# EAGLE design LEDBoard (EAGLE 8.4.1)
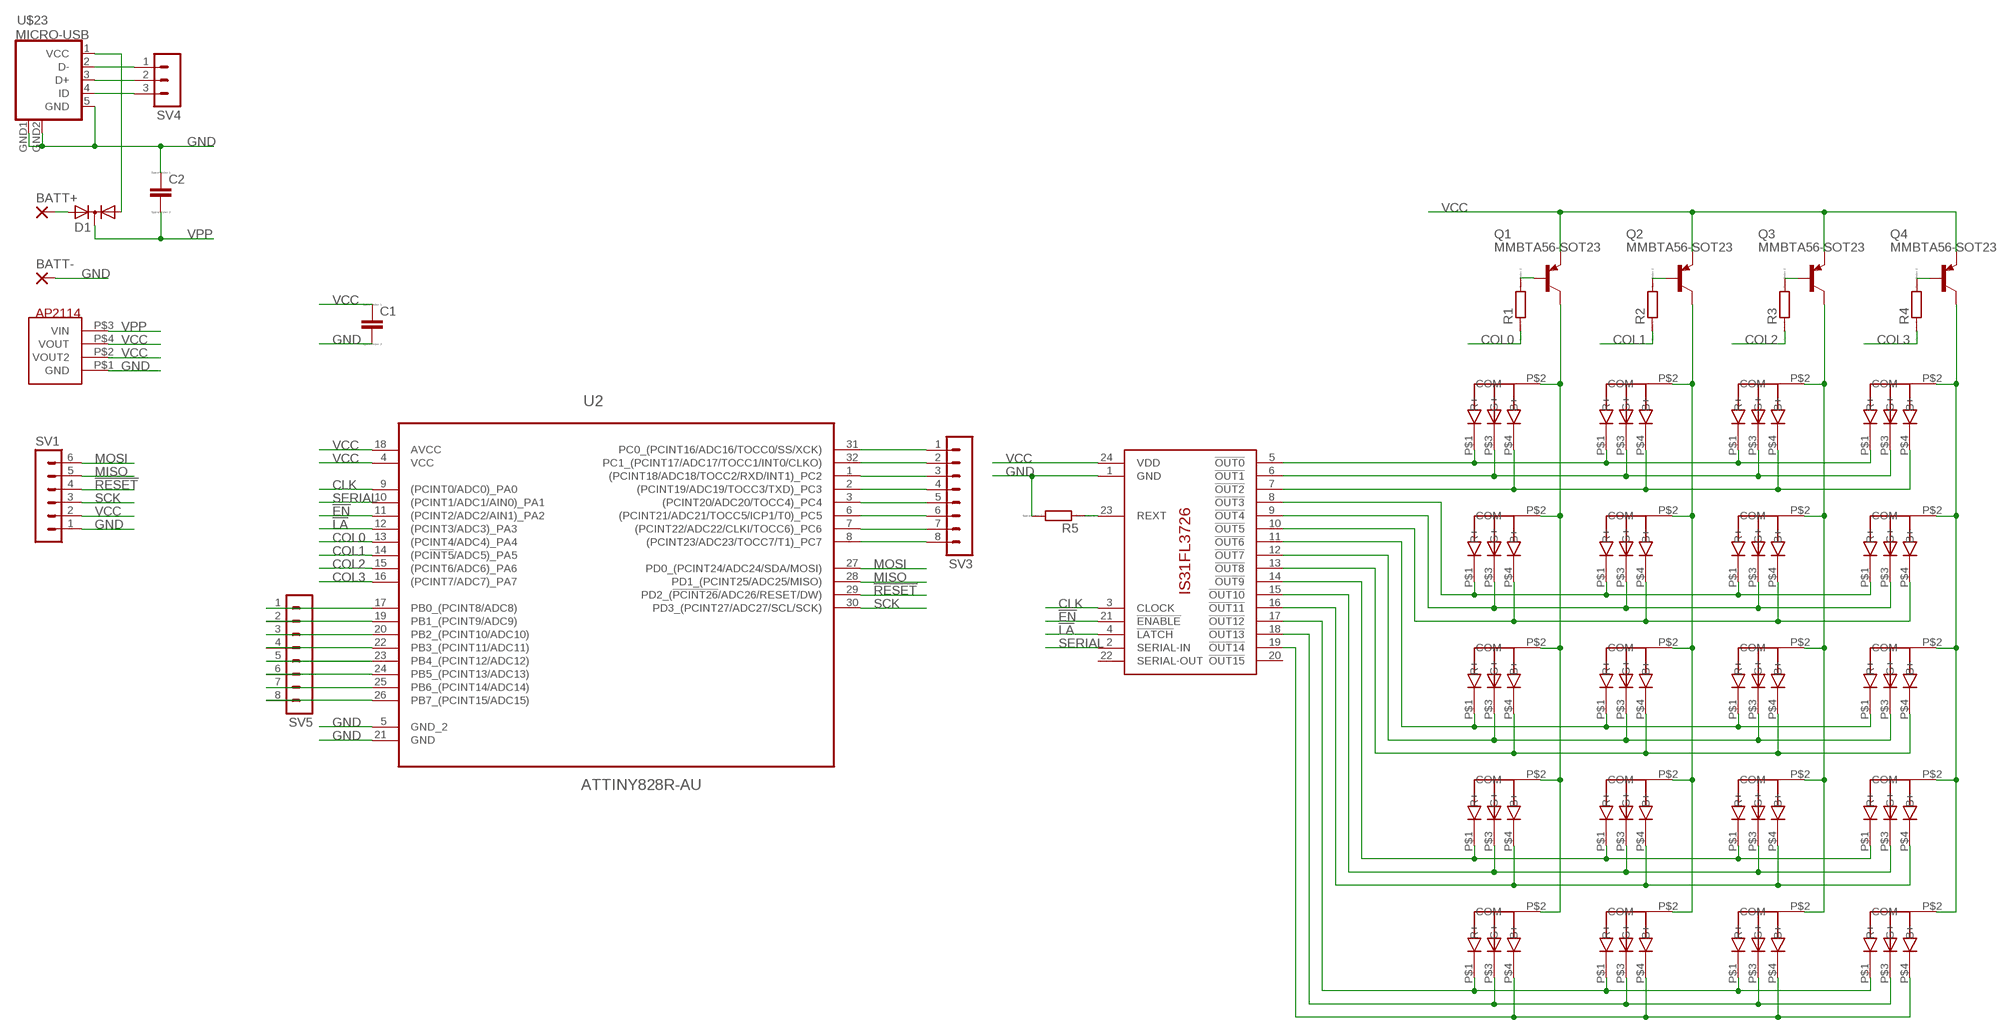
[diagram p0: schematic, sheet 1]

## Parts
BATT+  2,54/1,1  [2,54/1,1]
BATT-  2,54/1,1  [2,54/1,1]
C1  CC1206  [C1206]
C2  CC1206  [C1206]
D1  DIODE-2AC|CASOT23  [SOT23]
Q1  MMBTA56-SOT23  [SOT23]
Q2  MMBTA56-SOT23  [SOT23]
Q3  MMBTA56-SOT23  [SOT23]
Q4  MMBTA56-SOT23  [SOT23]
R1  RR1206  [R1206]
R2  RR1206  [R1206]
R3  RR1206  [R1206]
R4  RR1206  [R1206]
R5  RR1206  [R1206]
SV1  MA06-1  [MA06-1]
SV3  MA08-1  [MA08-1]
SV4  MA03-1  [MA03-1]
SV5  MA08-1  [MA08-1]
U2  ATTINY828R-AU  [QFP80P900X900X120-32N]
U$1  IS31FL3726  [TSSOP-24]
U$2  AP2114H  [SOT233]
U$3  3528LED  [3528]
U$4  3528LED  [3528]
U$5  3528LED  [3528]
U$6  3528LED  [3528]
U$7  3528LED  [3528]
U$8  3528LED  [3528]
U$9  3528LED  [3528]
U$10  3528LED  [3528]
U$11  3528LED  [3528]
U$12  3528LED  [3528]
U$13  3528LED  [3528]
U$14  3528LED  [3528]
U$15  3528LED  [3528]
U$16  3528LED  [3528]
U$17  3528LED  [3528]
U$18  3528LED  [3528]
U$19  3528LED  [3528]
U$20  3528LED  [3528]
U$21  3528LED  [3528]
U$22  3528LED  [3528]
U$23  MICRO-USB  [MICRO-USB]

## Nets
!EN: U2.11((PCINT2/ADC2/AIN1)_PA2) U$1.21(!ENABLE)
!LA: U2.12((PCINT3/ADC3)_PA3) U$1.4(!LATCH)
!RESET: SV1.4 U2.29(PD2_(!PCINT26!/ADC26/RESET/DW))
CLK: U2.9((PCINT0/ADC0)_PA0) U$1.3(CLOCK)
COL0: R1.1 U2.13((PCINT4/ADC4)_PA4)
COL1: R2.1 U2.14((PC!INT5!/ADC5)_PA5)
COL2: R3.1 U2.15((PCINT6/ADC6)_PA6)
COL3: R4.1 U2.16((PCINT7/ADC7)_PA7)
GND: BATT-.1(P) C1.2 C2.1 R5.2 SV1.1 U2.5(GND_2) U2.21(GND) U$1.1(GND) U$2.P$1(GND) U$23.5(GND) U$23.GND1(GND) U$23.GND2(GND)
MISO: SV1.5 U2.28(PD1_(PCINT25/ADC25/MISO))
MOSI: SV1.6 U2.27(PD0_(PCINT24/ADC24/SDA/MOSI))
N$1: SV3.1 U2.31(PC0_(PCINT16/ADC16/TOCC0/SS/XCK))
N$2: SV3.2 U2.32(PC1_(PCINT17/ADC17/TOCC1/INT0/CLKO))
N$3: U$1.5(!OUT0) U$7.P$1(R+) U$8.P$1(R+) U$9.P$1(R+) U$10.P$1(R+)
N$4: U$1.6(!OUT1) U$7.P$3(G+) U$8.P$3(G+) U$9.P$3(G+) U$10.P$3(G+)
N$5: U$1.7(!OUT2) U$7.P$4(B+) U$8.P$4(B+) U$9.P$4(B+) U$10.P$4(B+)
N$6: U$1.8(!OUT3) U$3.P$1(R+) U$4.P$1(R+) U$5.P$1(R+) U$6.P$1(R+)
N$7: U$1.9(!OUT4) U$3.P$3(G+) U$4.P$3(G+) U$5.P$3(G+) U$6.P$3(G+)
N$8: U$1.10(!OUT5) U$3.P$4(B+) U$4.P$4(B+) U$5.P$4(B+) U$6.P$4(B+)
N$9: U$1.11(!OUT6) U$11.P$1(R+) U$12.P$1(R+) U$13.P$1(R+) U$14.P$1(R+)
N$10: U$1.12(!OUT7) U$11.P$3(G+) U$12.P$3(G+) U$13.P$3(G+) U$14.P$3(G+)
N$11: U$1.13(!OUT8) U$11.P$4(B+) U$12.P$4(B+) U$13.P$4(B+) U$14.P$4(B+)
N$12: U$1.14(!OUT9) U$15.P$1(R+) U$16.P$1(R+) U$17.P$1(R+) U$18.P$1(R+)
N$13: U$1.15(!OUT10) U$15.P$3(G+) U$16.P$3(G+) U$17.P$3(G+) U$18.P$3(G+)
N$14: U$1.16(!OUT11) U$15.P$4(B+) U$16.P$4(B+) U$17.P$4(B+) U$18.P$4(B+)
N$15: U$1.17(!OUT12) U$19.P$1(R+) U$20.P$1(R+) U$21.P$1(R+) U$22.P$1(R+)
N$16: U$1.18(!OUT13) U$19.P$3(G+) U$20.P$3(G+) U$21.P$3(G+) U$22.P$3(G+)
N$17: U$1.19(!OUT14) U$19.P$4(B+) U$20.P$4(B+) U$21.P$4(B+) U$22.P$4(B+)
N$18: Q1.3(C) U$3.P$2(COM) U$7.P$2(COM) U$11.P$2(COM) U$15.P$2(COM) U$22.P$2(COM)
N$19: Q2.3(C) U$4.P$2(COM) U$8.P$2(COM) U$12.P$2(COM) U$16.P$2(COM) U$21.P$2(COM)
N$20: Q3.3(C) U$5.P$2(COM) U$9.P$2(COM) U$13.P$2(COM) U$17.P$2(COM) U$20.P$2(COM)
N$21: Q4.3(C) U$6.P$2(COM) U$10.P$2(COM) U$14.P$2(COM) U$18.P$2(COM) U$19.P$2(COM)
N$22: Q1.1(B) R1.2
N$23: Q2.1(B) R2.2
N$24: Q3.1(B) R3.2
N$25: Q4.1(B) R4.2
N$26: R5.1 U$1.23(REXT)
N$27: SV3.3 U2.1((PCINT18/ADC18/TOCC2/RXD/INT1)_PC2)
N$28: SV3.4 U2.2((PCINT19/ADC19/TOCC3/TXD)_PC3)
N$29: SV3.5 U2.3((PCINT20/ADC20/TOCC4)_PC4)
N$30: SV3.6 U2.6((PCINT21/ADC21/TOCC5/ICP1/T0)_PC5)
N$31: SV3.7 U2.7((PCINT22/ADC22/CLKI/TOCC6)_PC6)
N$32: SV3.8 U2.8((PCINT23/ADC23/TOCC7/T1)_PC7)
N$33: SV5.1 U2.17(PB0_(PCINT8/ADC8))
N$34: SV5.2 U2.19(PB1_(PCINT9/ADC9))
N$35: SV5.3 U2.20(PB2_(PCINT10/ADC10))
N$36: SV5.4 U2.22(PB3_(PCINT11/ADC11))
N$37: SV5.5 U2.23(PB4_(PCINT12/ADC12))
N$38: SV5.6 U2.24(PB5_(PCINT13/ADC13))
N$39: SV5.7 U2.25(PB6_(PCINT14/ADC14))
N$40: SV5.8 U2.26(PB7_(PCINT15/ADC15))
N$41: SV4.1 U$23.2(D-)
N$42: D1.1(A1) U$23.1(VCC)
N$43: SV4.2 U$23.3(D+)
N$44: BATT+.1(P) D1.2(A2)
N$45: SV4.3 U$23.4(ID)
SCK: SV1.3 U2.30(PD3_(PCINT27/ADC27/SCL/SCK))
SERIAL: U2.10((PCINT1/ADC1/AIN0)_PA1) U$1.2(SERIAL-IN)
VCC: C1.1 Q1.2(E) Q2.2(E) Q3.2(E) Q4.2(E) SV1.2 U2.4(VCC) U2.18(AVCC) U$1.24(VDD) U$2.P$2(VOUT2) U$2.P$4(VOUT)
VPP: C2.2 D1.3(C) U$2.P$3(VIN)
Unconnected: U$1.20(!OUT15) U$1.22(SERIAL-OUT)

## Library data of the parts
BATT+ BATT- = wirepad:2,54/1,1: THROUGH-HOLE PAD
C1 C2 = eagle-ltspice:C: CAPACITOR, European symbol; SPICEMODEL: NONE; SPICEPREFIX: C
D1 = diode:DIODE-2AC|CA: Dual DIODE Anode-Cathode|Cathode-Anode
Q1-Q4 = transistor-pnp:*-?: PNP Transistor
R1-R5 = eagle-ltspice:R: RESISTOR, European symbol; SPICEMODEL: NONE; SPICEPREFIX: R
SV1 = con-lstb:MA06-1: PIN HEADER; OC_FARNELL: unknown; OC_NEWARK: unknown
SV3 SV5 = con-lstb:MA08-1: PIN HEADER; OC_FARNELL: unknown; OC_NEWARK: unknown
SV4 = con-lstb:MA03-1: PIN HEADER; OC_FARNELL: unknown; OC_NEWARK: unknown
U2 = Custom:ATTINY828R-AU: IC, MCU, 8KB, FLASH, 20MHZ, TQFP-32; MPN: ATTINY828R-AU; OC_FARNELL: 2249850; OC_NEWARK: Unknown; PACKAGE: TQFP-32; SUPPLIER: ATMEL
U$1 = Custom:IS31FL3726
U$2 = Custom:AP2114H
U$3-U$22 = Custom:3528LED
U$23 = microusb:MICRO-USB: Micro USB B connector

## Board
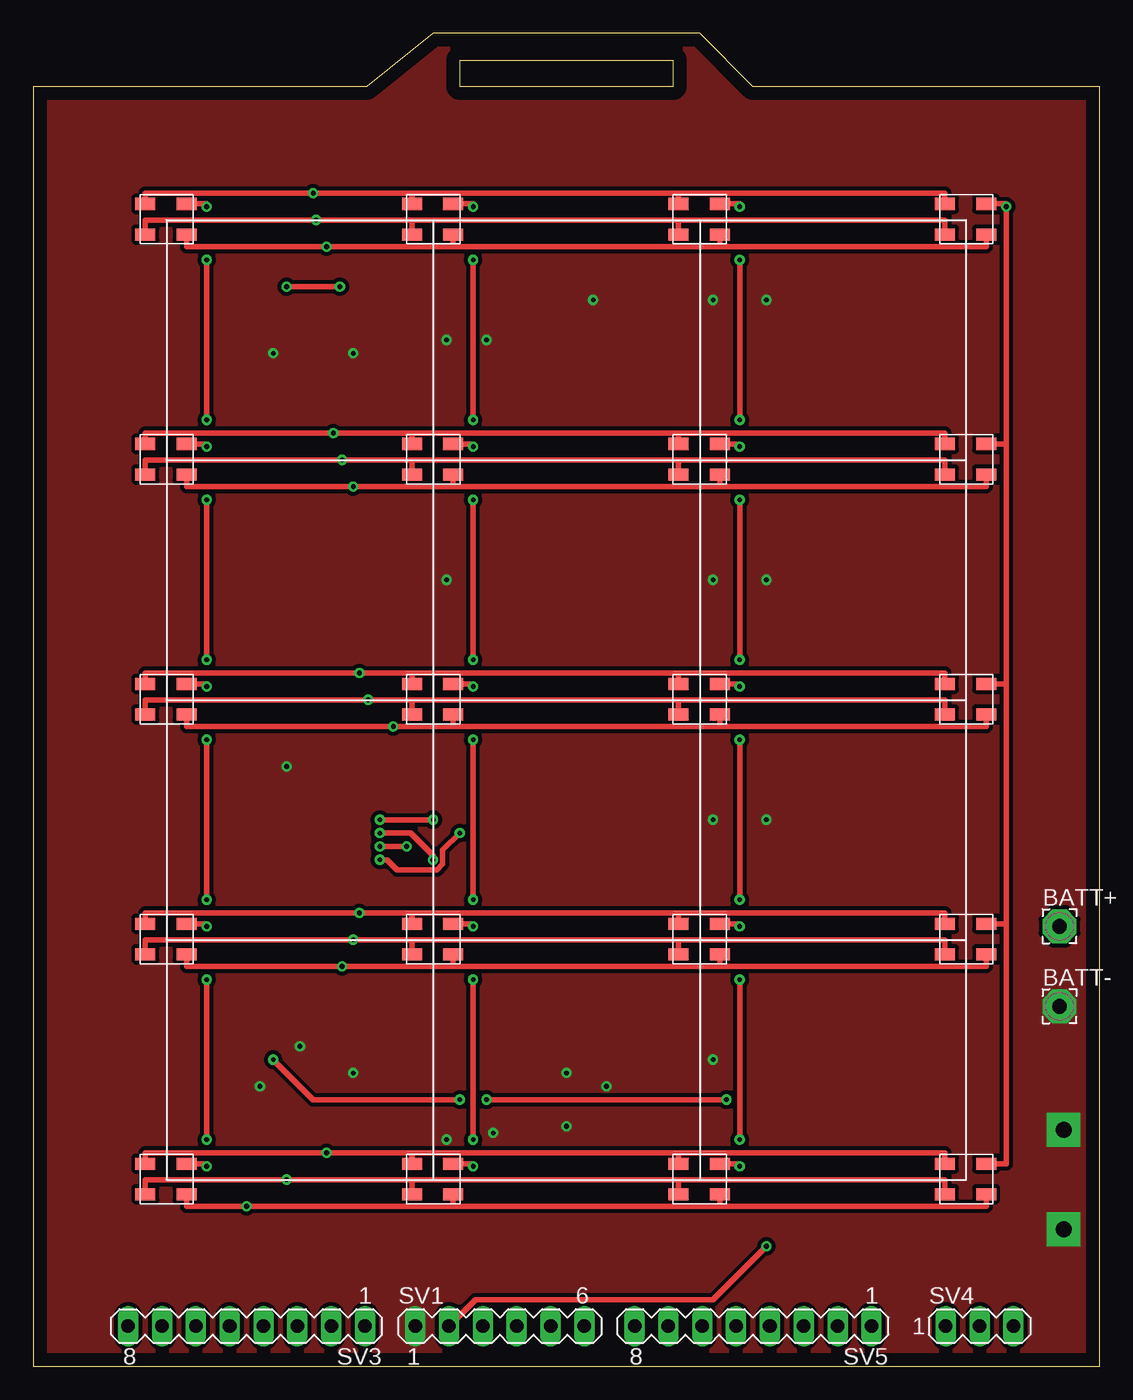
[diagram p1: board, top side]
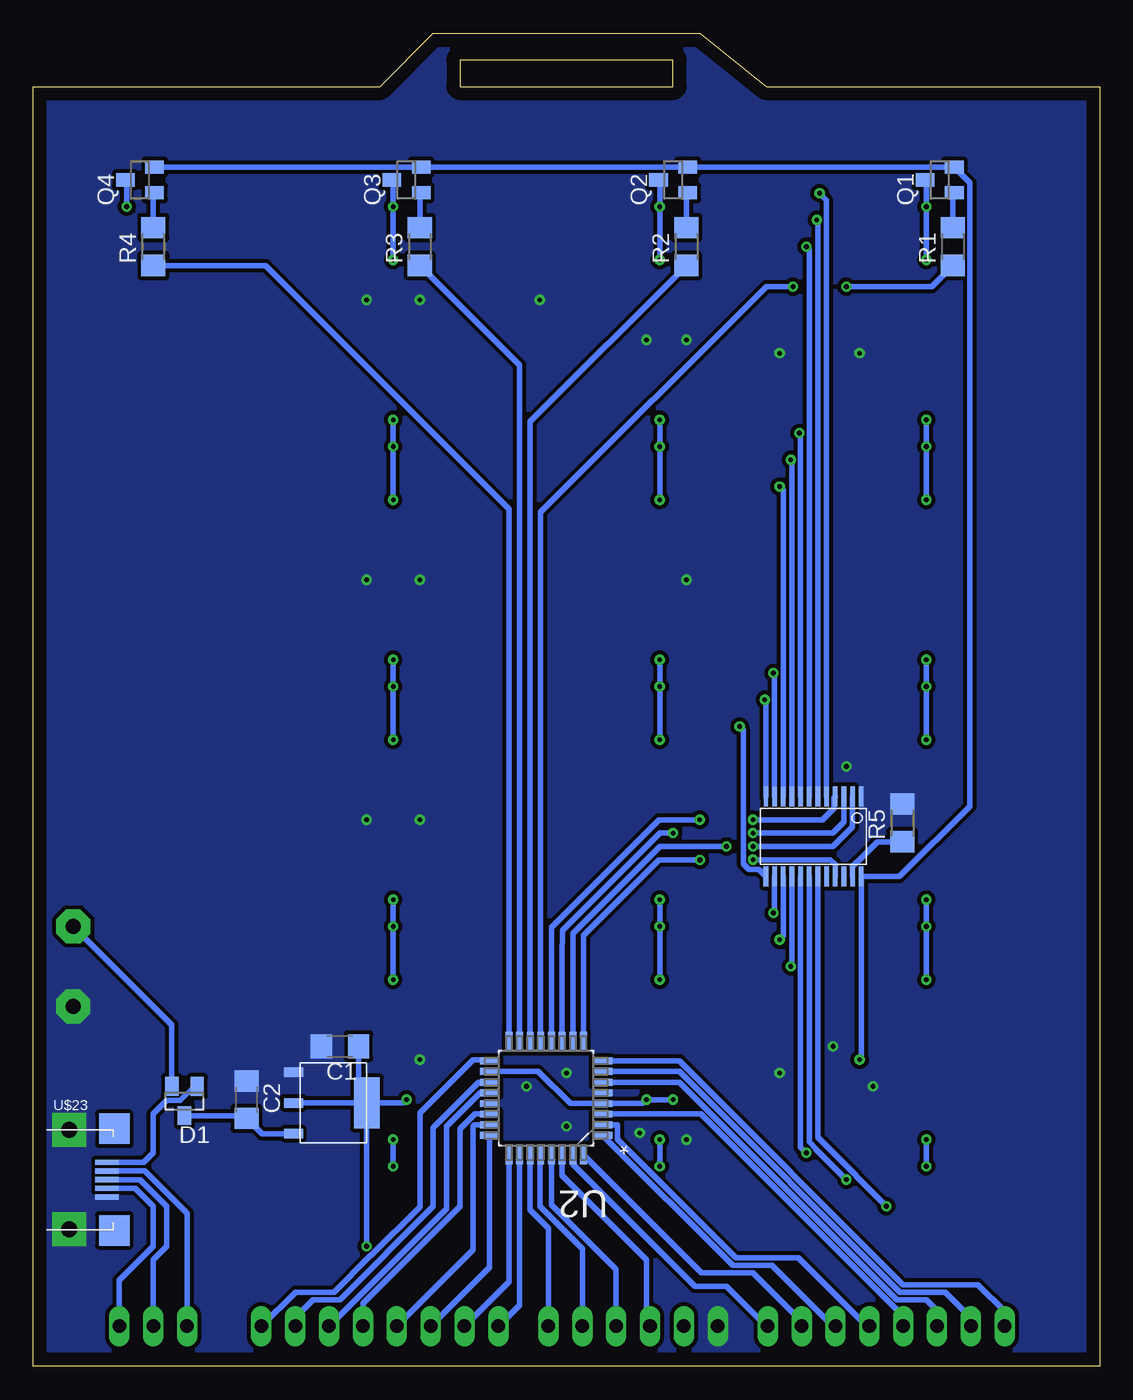
[diagram p2: board, bottom side, seen from below]

Size 80 x 100 mm. Coordinates in mm from the lower left corner, seen from the top.
Outline: 0,0 80,0 80,96 54,96 50,100 30,100 25,96 0,96 0,0
Outline: 32,98 48,98 48,96 32,96 32,98
Copper layers (1*16): Top 0.035mm / dielectric 1.5mm / Bottom 0.035mm
Design rules "default": minimum track width 6mil, minimum drill 0.35mm, track to track 6mil, track to pad 6mil, pad to pad 6mil, via to via 6mil, smd to smd 6mil, copper to edge 40mil, drill to drill 6mil, minimum pad ring 10mil, minimum via ring 8mil, stop-mask expansion 4mil, vias tented up to drill 0mil, thermal gap 10mil

### Footprints (pad centres in the part's own frame; a part is rotated, then mirrored left to right if it is on the bottom)
2,54/1,1 = drill 1.118 pad 2.54 octagon: 1 0,0
C1206 = smd 1.6 x 1.8: 1 -1.4,0; 2 1.4,0
SOT23 = smd 1 x 1.4: 1 -0.95,-1.1; 2 0.95,-1.1; 3 0,1.1
R1206 = smd 1.6 x 1.803: 1 -1.422,0; 2 1.422,0
MA06-1 = drill 1.016 long: 1 -6.35,0; 2 -3.81,0; 3 -1.27,0; 4 1.27,0; 5 3.81,0; 6 6.35,0
MA08-1 = drill 1.016 long: 1 -8.89,0; 2 -6.35,0; 3 -3.81,0; 4 -1.27,0; 5 1.27,0; 6 3.81,0; 7 6.35,0; 8 8.89,0
MA03-1 = drill 1.016 long: 1 -2.54,0; 2 0,0; 3 2.54,0
QFP80P900X900X120-32N = smd 1.473 x 0.508: 1 -4.242,2.794; 2 -4.242,2.007; 3 -4.242,1.194; 4 -4.242,0.406; 5 -4.242,-0.406; 6 -4.242,-1.194; 7 -4.242,-2.007; 8 -4.242,-2.794; 17 4.242,-2.794; 18 4.242,-2.007; 19 4.242,-1.194; 20 4.242,-0.406; 21 4.242,0.406; 22 4.242,1.194; 23 4.242,2.007; 24 4.242,2.794 | smd 0.508 x 1.473: 9 -2.794,-4.242; 10 -2.007,-4.242; 11 -1.194,-4.242; 12 -0.406,-4.242; 13 0.406,-4.242; 14 1.194,-4.242; 15 2.007,-4.242; 16 2.794,-4.242; 25 2.794,4.242; 26 2.007,4.242; 27 1.194,4.242; 28 0.406,4.242; 29 -0.406,4.242; 30 -1.194,4.242; 31 -2.007,4.242; 32 -2.794,4.242
TSSOP-24 = smd 0.35 x 1.5: 1 -3.4,-3; 2 -2.75,-3; 3 -2.1,-3; 4 -1.45,-3; 5 -0.8,-3; 6 -0.15,-3; 7 0.5,-3; 8 1.15,-3; 9 1.8,-3; 10 2.45,-3; 11 3.1,-3; 13 3.75,3; 14 3.1,3; 15 2.45,3; 16 1.8,3; 17 1.15,3; 18 0.5,3; 19 -0.15,3; 20 -0.8,3; 21 -1.45,3; 22 -2.1,3; 23 -2.75,3; 24 -3.4,3 | smd 0.3 x 1.5: 12 3.75,-3
SOT233 = smd 0.711 x 1.422: P$1 -2.3,-4.5; P$2 0,-4.5; P$3 2.3,-4.5 | smd 3.81 x 1.93: P$4 0,1
3528 = smd 1.5 x 0.9: P$1 -1.6,1.2; P$2 1.5,1.2; P$3 -1.6,-1.1; P$4 1.5,-1.1
MICRO-USB = smd 0.4 x 1.75: 1 -1.3,4.525; 2 -0.65,4.525; 3 0,4.525; 4 0.65,4.525; 5 1.3,4.525 | smd 2.286 x 2.286: 6 -3.81,5.08; 7 3.81,5.08 | drill 1.2 pad 2.54 square: GND1 -3.725,1.7; GND2 3.725,1.7

### Placement (x,y rotation side)
BATT+  77,33 0 top
BATT-  77,27 0 top
C1  57,24 180 bottom
C2  64,20 270 bottom
D1  68.66,19.9 180 bottom
Q1  12,89 90 bottom
Q2  32,89 90 bottom
Q3  52,89 90 bottom
Q4  72,89 90 bottom
R1  11,84 90 bottom
R2  31,84 90 bottom
R3  51,84 90 bottom
R4  71,84 90 bottom
R5  14.8,40.76 90 bottom
SV1  35,3 0 top
SV3  16,3 180 top
SV4  71,3 0 top
SV5  54,3 180 top
U2  41.52,20.11 180 bottom
U$1  21.28,39.73 180 bottom
U$2  55.98,19.75 270 bottom
U$3  10,68 0 top
U$4  30,68 0 top
U$5  50,68 0 top
U$6  70,68 0 top
U$7  10,86 0 top
U$8  30,86 0 top
U$9  50,86 0 top
U$10  70,86 0 top
U$11  10,50 0 top
U$12  30,50 0 top
U$13  50,50 0 top
U$14  70,50 0 top
U$15  10,32 0 top
U$16  30,32 0 top
U$17  50,32 0 top
U$18  70,32 0 top
U$19  70,14 0 top
U$20  50,14 0 top
U$21  30,14 0 top
U$22  10,14 0 top
U$23  79,14 270 bottom

### Tracks (layer width: path | path; a pad name or v marks a point on that pad's centre or on a via)
!EN  (via drill 0.35)
  Top 0.406: v26,38 26.53,38 27.29,37.25 30.29,37.25 30.71,37.68 30.71,38.72 v32,40
  Bottom 0.406: U2.11 40.33,30.71 40.29,32.71 33,40 v32,40 | U$1.21 19.83,37.63 20.2,38 v26,38
!LA  (via drill 0.35)
  Top 0.406: v30,41 v26,41
  Bottom 0.406: U$1.4 19.92,42.64 19.92,41.86 20.78,41 v26,41 | v30,41 33.04,41 41.11,32.92 U2.12
!RESET
  Bottom 0.406: U2.29 41.11,12.11 36.27,7.27 SV1.4
CLK  (via drill 0.35)
  Top 0.406: v29.98,37.98 29.98,38.32 28.3,40 v26,40
  Bottom 0.406: U2.9 38.73,32.31 33.04,38 30,38 v29.98,37.98 | U$1.3 19.18,40.82 20,40 v26,40
COL0  (via drill 0.35)
  Top 0.406: v23,81 v19,81
  Bottom 0.406: v19,81 12.58,81 R1.1 | v23,81 25,81 41.93,64.07 U2.13
COL1
  Bottom 0.406: R2.1 42.71,70.86 U2.14
COL2
  Bottom 0.406: R3.1 43.53,75.11 U2.15
COL3
  Bottom 0.406: U2.16 44.31,64.31 62.58,82.58 R4.1
GND  (via drill 0.35)
  other vias: 43,21 40,22 19,45 18,76 34,77 42,80 55,80 51,80 24,76 31,77 51,59 55,59 55,41 51,41 31,59 24,22 20,24 17,21 51,23 40,18 31,17 34.5,17.5
  pour Bottom (isolate 0.305, no thermals): 0,96 25,96 30,100 50,100 54,96 80,96 80,0 0,0
  pour Top (isolate 0.305, no thermals): 0,96 25,96 30,100 50,100 54,96 80,96 80,0 0,0
MISO
  Bottom 0.406: SV1.5 38.81,8.81 42,12 42,15.79 U2.28
MOSI
  Bottom 0.406: U2.27 42.71,11.71 41.35,10.35 SV1.6
N$1
  Bottom 0.406: SV3.1 25,3 28,6 30.35,6 39.51,15.16 U2.31
N$2
  Bottom 0.406: U2.32 29.86,7 26,7 22.35,3.35 SV3.2
N$3  (via drill 0.35)
  Top 0.406: U$10.P$1 68.4,88 52.4,88 52.4,88.01 48.4,88.01 | 28.4,88.01 48.4,88.01 | 28.4,88.01 v21,88.01 10.6,88.01 10.6,88 8.4,88 U$7.P$1 | U$9.P$1 48.4,88.01 | U$8.P$1 28.4,88.01
  Bottom 0.406: U$1.5 20.48,87.49 v21,88.01
N$4  (via drill 0.35)
  Top 0.406: U$10.P$3 68.4,86 48.4,86 | 28.4,86 v21.21,86 8.4,86 U$7.P$3 | 48.4,86 28.4,86 | U$8.P$3 28.4,86 | U$9.P$3 48.4,86
  Bottom 0.406: v21.21,86 21.13,85.92 U$1.6
N$5  (via drill 0.35)
  Top 0.406: U$10.P$4 71.5,84 51.5,84 | 31.5,84 v22,84 11.5,84 U$7.P$4 | 51.5,84 31.5,84 | U$8.P$4 31.5,84 | U$9.P$4 51.5,84
  Bottom 0.406: v22,84 21.78,83.78 U$1.7
N$6  (via drill 0.35)
  Top 0.406: U$6.P$1 68.4,70 52.4,70 52.4,70.01 48.4,70.01 | 48.4,70.01 28.4,70.01 | 28.4,70.01 v22.51,70.01 10.6,70.01 10.6,70 8.4,70 U$3.P$1 | U$4.P$1 28.4,70.01 | U$5.P$1 48.4,70.01
  Bottom 0.406: v22.51,70.01 22.43,69.92 U$1.8
N$7  (via drill 0.35)
  Top 0.406: U$6.P$3 68.4,68 48.4,68 | 28.4,68 48.4,68 | 28.4,68 v23.16,68 8.4,68 U$3.P$3 | U$5.P$3 48.4,68 | U$4.P$3 28.4,68
  Bottom 0.406: v23.16,68 23.08,67.92 U$1.9
N$8  (via drill 0.35)
  Top 0.406: U$6.P$4 71.5,66 51.5,66 | 31.5,66 51.5,66 | 31.5,66 v24,66 11.5,66 U$3.P$4 | U$5.P$4 51.5,66 | U$4.P$4 31.5,66
  Bottom 0.406: v24,66 23.73,65.73 U$1.10
N$9  (via drill 0.35)
  Top 0.406: U$14.P$1 68.4,52 52.4,52 52.4,52.01 48.4,52.01 | 28.4,52.01 48.4,52.01 | 28.4,52.01 v24.46,52.01 10.6,52.01 10.6,52 8.4,52 U$11.P$1 | U$13.P$1 48.4,52.01 | U$12.P$1 28.4,52.01
  Bottom 0.406: U$1.11 24.38,51.92 v24.46,52.01
N$10  (via drill 0.35)
  Top 0.406: U$14.P$3 68.4,50 48.4,50 | 28.4,50 48.4,50 | 28.4,50 v25.11,50 8.4,50 U$11.P$3 | U$13.P$3 48.4,50 | U$12.P$3 28.4,50
  Bottom 0.406: U$1.12 25.03,49.92 v25.11,50
N$11  (via drill 0.35)
  Top 0.406: U$14.P$4 71.5,48 51.5,48 | 31.5,48 v27,48 11.5,48 U$11.P$4 | U$13.P$4 51.5,48 | U$12.P$4 31.5,48 | 51.5,48 31.5,48
  Bottom 0.406: U$1.13 25.57,37.27 26.3,37.27 26.73,37.7 26.73,47.73 v27,48
N$12  (via drill 0.35)
  Top 0.406: U$18.P$1 68.4,34 52.4,34 52.4,34.01 48.4,34.01 | 28.4,34.01 48.4,34.01 | 28.4,34.01 v24.46,34.01 10.6,34.01 10.6,34 8.4,34 U$15.P$1 | U$17.P$1 48.4,34.01 | U$16.P$1 28.4,34.01
  Bottom 0.406: v24.46,34.01 24.38,34.09 U$1.14
N$13  (via drill 0.35)
  Top 0.406: U$18.P$3 68.4,32 48.4,32 | 28.4,32 v24,32 8.4,32 U$15.P$3 | 48.4,32 28.4,32 | U$16.P$3 28.4,32 | U$17.P$3 48.4,32
  Bottom 0.406: v24,32 23.73,32.27 U$1.15
N$14  (via drill 0.35)
  Top 0.406: U$18.P$4 71.5,30 51.5,30 | 31.5,30 v23.16,30 11.5,30 U$15.P$4 | 51.5,30 31.5,30 | U$16.P$4 31.5,30 | U$17.P$4 51.5,30
  Bottom 0.406: v23.16,30 23.08,30.08 U$1.16
N$15  (via drill 0.35)
  Top 0.406: U$19.P$1 68.4,16 52.4,16 52.4,16.01 48.4,16.01 | 28.4,16.01 48.4,16.01 | 28.4,16.01 v22,16.01 10.6,16.01 10.6,16 8.4,16 U$22.P$1 | U$20.P$1 48.4,16.01 | U$21.P$1 28.4,16.01
  Bottom 0.406: v22,16.01 22.43,16.44 U$1.17
N$16  (via drill 0.35)
  Top 0.406: U$19.P$3 68.4,14 48.4,14 | 28.4,14 48.4,14 | 28.4,14 v19,14 8.4,14 U$22.P$3 | U$20.P$3 48.4,14 | U$21.P$3 28.4,14
  Bottom 0.406: U$1.18 21.78,18 21.78,17.82 21.78,16.82 21.27,16.31 21.27,16.27 v19,14
N$17  (via drill 0.35)
  Top 0.406: U$19.P$4 71.5,12 51.5,12 | 31.5,12 51.5,12 | 31.5,12 v16,12 11.5,12 U$22.P$4 | U$20.P$4 51.5,12 | U$21.P$4 31.5,12
  Bottom 0.406: v16,12 18.27,14.27 18.27,14.3 21.13,17.17 U$1.19
N$18  (via drill 0.35)
  Top 0.406: 11.5,15 U$22.P$2 13,15.2 v13,15 | v13,17 v13,29 | v13,33 13,33.2 U$15.P$2 | v13,35 v13,47 | v13,51 13,51.2 U$11.P$2 | v13,53 v13,65 | v13,69 13,69.2 U$3.P$2 | v13,71 v13,83 | v13,87 13,87.2 U$7.P$2
  Bottom 0.406: v13,15 v13,17 | v13,29 v13,33 v13,35 | v13,47 v13,51 v13,53 | v13,65 v13,69 v13,71 | v13,83 v13,87 13,88.9 Q1.3
N$19  (via drill 0.35)
  Top 0.406: U$21.P$2 33,15.2 v33,15 | v33,17 v33,29 | v33,33 33,33.2 U$16.P$2 | v33,35 v33,47 | v33,51 33,51.2 U$12.P$2 | v33,53 v33,65 | v33,69 33,69.2 U$4.P$2 | v33,71 v33,83 | v33,87 33,87.2 U$8.P$2
  Bottom 0.406: v33,15 v33,17 | v33,29 v33,33 v33,35 | v33,47 v33,51 v33,53 | v33,65 v33,69 v33,71 | v33,83 v33,87 33,88.9 Q2.3
N$20  (via drill 0.35)
  Top 0.406: U$20.P$2 53,15.2 v53,15 | v53,17 v53,29 | v53,33 53,33.2 U$17.P$2 | v53,35 v53,47 | v53,51 53,51.2 U$13.P$2 | v53,53 v53,65 | v53,69 53,69.2 U$5.P$2 | v53,71 v53,83 | v53,87 53,87.2 U$9.P$2
  Bottom 0.406: v53,15 v53,17 | v53,29 v53,33 v53,35 | v53,47 v53,51 v53,53 | v53,65 v53,69 v53,71 | v53,83 v53,87 53,88.9 Q3.3
N$21  (via drill 0.35)
  Top 0.406: U$19.P$2 73,15.2 73,33.2 | 73,69.2 v73,87 73,87.2 U$10.P$2 | 73,51.2 73,69.2 | 73,33.2 73,51.2 | U$6.P$2 73,69.2 | U$14.P$2 73,51.2 | U$18.P$2 73,33.2
  Bottom 0.406: v73,87 73,88.9 Q4.3
N$22
  Bottom 0.406: 11,84.95 R1.2 11,87.95 Q1.1
N$23
  Bottom 0.406: 31,84.95 R2.2 31,87.95 Q2.1
N$24
  Bottom 0.406: 51,84.95 R3.2 51,87.95 Q3.1
N$25
  Bottom 0.406: 71,84.95 R4.2 71,87.95 Q4.1
N$26
  Bottom 0.406: U$1.23 18.53,37.51 18.2,37.84 18.16,37.84 16.66,39.34 R5.1
N$27
  Bottom 0.406: U2.1 27.52,7.56 24.57,7.56 20.01,3 SV3.3
N$28
  Bottom 0.406: SV3.4 17.47,3 22.59,8.12 27.29,8.12 36.19,17.01 36.19,18.1 U2.2
N$29
  Bottom 0.406: U2.3 29.92,18.92 14.73,3.73 SV3.5
N$30
  Bottom 0.406: SV3.6 12.19,4.19 13,5 15.21,5 31.51,21.3 U2.6
N$31
  Bottom 0.406: SV3.7 9.65,3.65 11.56,5.56 14.98,5.56 31.54,22.12 U2.7
N$32
  Bottom 0.406: SV3.8 7.11,4.11 9.12,6.12 14.75,6.12 31.53,22.9 U2.8
N$33
  Bottom 0.406: U2.17 45.86,23 47,23 51,19 51,11.96 54.7,8.27 54.73,8.27 57.44,5.56 60.33,5.56 SV5.1
N$34
  Bottom 0.406: U2.19 46.6,21.3 50,17.9 50,12 57,5 59,5 60.35,3.65 SV5.2
N$35
  Bottom 0.406: 49,12 49,18 46.48,20.52 U2.20 | 49,12 49,11.81 | SV5.3 49,11.81 | 49,11.81 49,12
N$36
  Bottom 0.406: U2.22 46.87,18.92 48,17.79 48,12 55.27,4.73 SV5.4
N$37
  Bottom 0.406: U2.23 46.9,18.1 47,18 47,8.73 SV5.5
N$38
  Bottom 0.406: U2.24 45.76,7.43 SV5.6
N$39
  Bottom 0.406: U2.25 44.31,6.34 SV5.7
N$40
  Bottom 0.406: U2.26 43.53,4.58 SV5.8
N$41
  Bottom 0.406: SV4.1 68.46,11.46 71.65,14.65 U$23.2
N$42
  Bottom 0.406: D1.1 67.91,21 68.96,19.94 70,19.94 71,18.94 71,16 71.7,15.3 U$23.1
N$43
  Bottom 0.406: SV4.2 71,8 70,9 70,12 72,14 U$23.3
N$44
  Bottom 0.406: BATT+.1 69.61,25.61 D1.2
N$45
  Bottom 0.406: SV4.3 73.54,6.46 71,9 71,12 72.35,13.35 U$23.4
SCK
  Bottom 0.406: U2.30 40.33,14.33 34,8 34,3.27 SV1.3
SERIAL  (via drill 0.35)
  Top 0.406: v26,39 v28,39
  Bottom 0.406: U2.10 39.51,30 39.51,32.49 33,39 v28,39 | v26,39 20,39 18.53,40.47 U$1.2
VCC  (via drill 0.35)
  Top 0.406: v52,20 v34,20 | v32,20 21,20 v18,23 | SV1.2 33.19,5 51,5 v55,9
  Bottom 0.406: Q4.2 Q3.2 Q2.2 Q1.2 9.74,88.79 9.74,42 15.01,36.73 U$1.24 17.88,23.12 v18,23 | C1.1 55.6,20.37 U$2.P$4 | U$2.P$4 52.25,19.75 v52,20 | v32,20 v34,20 34.3,19.7 U2.4 39.7,19.7 42.12,22.12 U2.18 | U$2.P$2 U$2.P$4 | v55,9 54.98,9.02 U$2.P$4
VPP
  Bottom 0.406: D1.3 64.2,18.8 C2.2 62.85,17.45 U$2.P$3

### Text on the board
tDocu: GND VCC SCK !RESET! MISO MOSI | D- D+ ID
bDocu: T | T | T | T | 1K | 1k | 1k | 1k | 1K | C | C | D | Charlie Tenn | Version 0.0